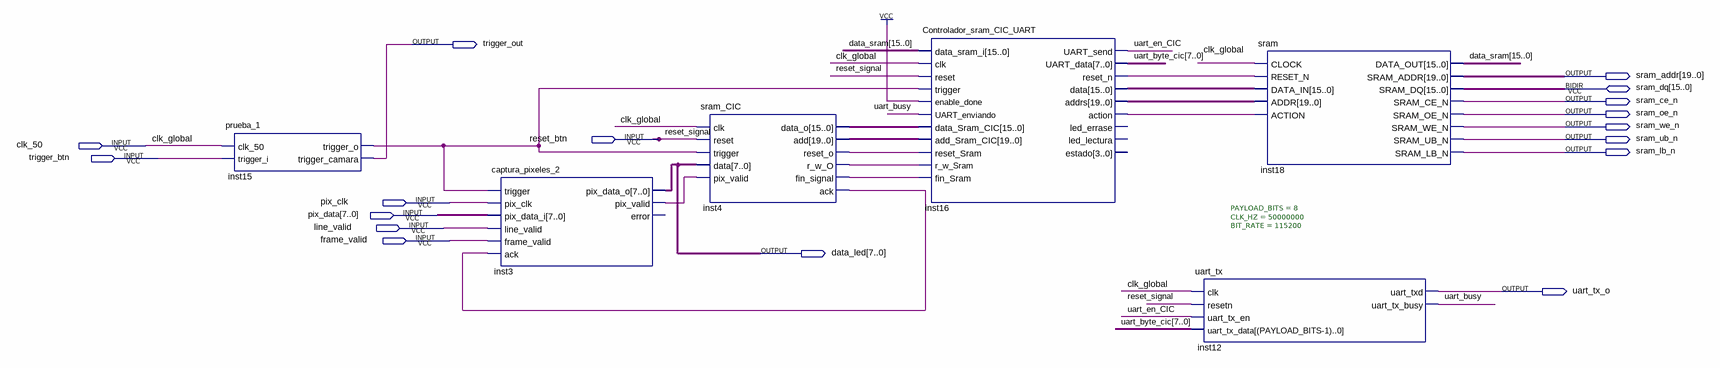
[diagram p0: schematic sheet]
// Quartus schematic Parte_DE2.bdf as structural Verilog: 6 symbols, 17 pins
module Parte_DE2 (
  input  reset_btn,
  input  clk_50,
  input  trigger_btn,
  input  pix_clk,
  input  [7:0] pix_data,
  input  line_valid,
  input  frame_valid,
  inout  [15:0] sram_dq,
  output trigger_out,
  output [19:0] sram_addr,
  output sram_ce_n,
  output sram_oe_n,
  output sram_we_n,
  output sram_ub_n,
  output sram_lb_n,
  output [7:0] data_led,
  output uart_tx_o
);

  wire inst3_pix_valid, inst4_ack, inst4_fin_signal, inst4_r_w_o, inst4_reset_o, inst15_trigger_o,
       inst16_action, inst16_reset_n, uart_busy, uart_en_CIC;
  wire [7:0] uart_byte_cic;
  wire [15:0] data_sram, inst4_data_o, inst16_data;
  wire [19:0] inst4_add, inst16_addrs;

  prueba_1 inst15 (
    .clk_50(clk_50), .trigger_i(trigger_btn), .trigger_o(inst15_trigger_o), .trigger_camara(trigger_out));
  captura_pixeles_2 inst3 (
    .trigger(inst15_trigger_o), .pix_clk(pix_clk), .pix_data_i(pix_data), .line_valid(line_valid),
    .frame_valid(frame_valid), .ack(inst4_ack), .pix_data_o(data_led), .pix_valid(inst3_pix_valid));  // open: error
  sram_CIC inst4 (
    .clk(clk_50), .reset(reset_btn), .trigger(inst15_trigger_o), .data(data_led),
    .pix_valid(inst3_pix_valid), .data_o(inst4_data_o), .add(inst4_add), .reset_o(inst4_reset_o),
    .r_w_O(inst4_r_w_o), .fin_signal(inst4_fin_signal), .ack(inst4_ack));
  Controlador_sram_CIC_UART inst16 (
    .data_sram_i(data_sram), .clk(clk_50), .reset(reset_btn), .trigger(inst15_trigger_o), .enable_done(1'b1),
    .UART_enviando(uart_busy), .data_Sram_CIC(inst4_data_o), .add_Sram_CIC(inst4_add),
    .reset_Sram(inst4_reset_o), .r_w_Sram(inst4_r_w_o), .fin_Sram(inst4_fin_signal), .UART_send(uart_en_CIC),
    .UART_data(uart_byte_cic), .reset_n(inst16_reset_n), .data(inst16_data), .addrs(inst16_addrs),
    .action(inst16_action));  // open: led_errase, led_lectura, estado
  uart_tx #(.PAYLOAD_BITS(8), .CLK_HZ(50000000), .BIT_RATE(115200)) inst12 (
    .clk(clk_50), .resetn(reset_btn), .uart_tx_en(uart_en_CIC), .uart_tx_data(uart_byte_cic),
    .uart_txd(uart_tx_o), .uart_tx_busy(uart_busy));
  sram inst18 (
    .CLOCK(clk_50), .RESET_N(inst16_reset_n), .DATA_IN(inst16_data), .ADDR(inst16_addrs),
    .ACTION(inst16_action), .DATA_OUT(data_sram), .SRAM_ADDR(sram_addr), .SRAM_CE_N(sram_ce_n),
    .SRAM_OE_N(sram_oe_n), .SRAM_WE_N(sram_we_n), .SRAM_UB_N(sram_ub_n), .SRAM_LB_N(sram_lb_n),
    .SRAM_DQ(sram_dq));

  // Other names for the same wires on the sheet: clk_global = clk_50; reset_signal = reset_btn
endmodule
